# Altium schematic sheet Sheet2.SchDoc
size A4; SheetNumber: 1; SheetTotal: 1
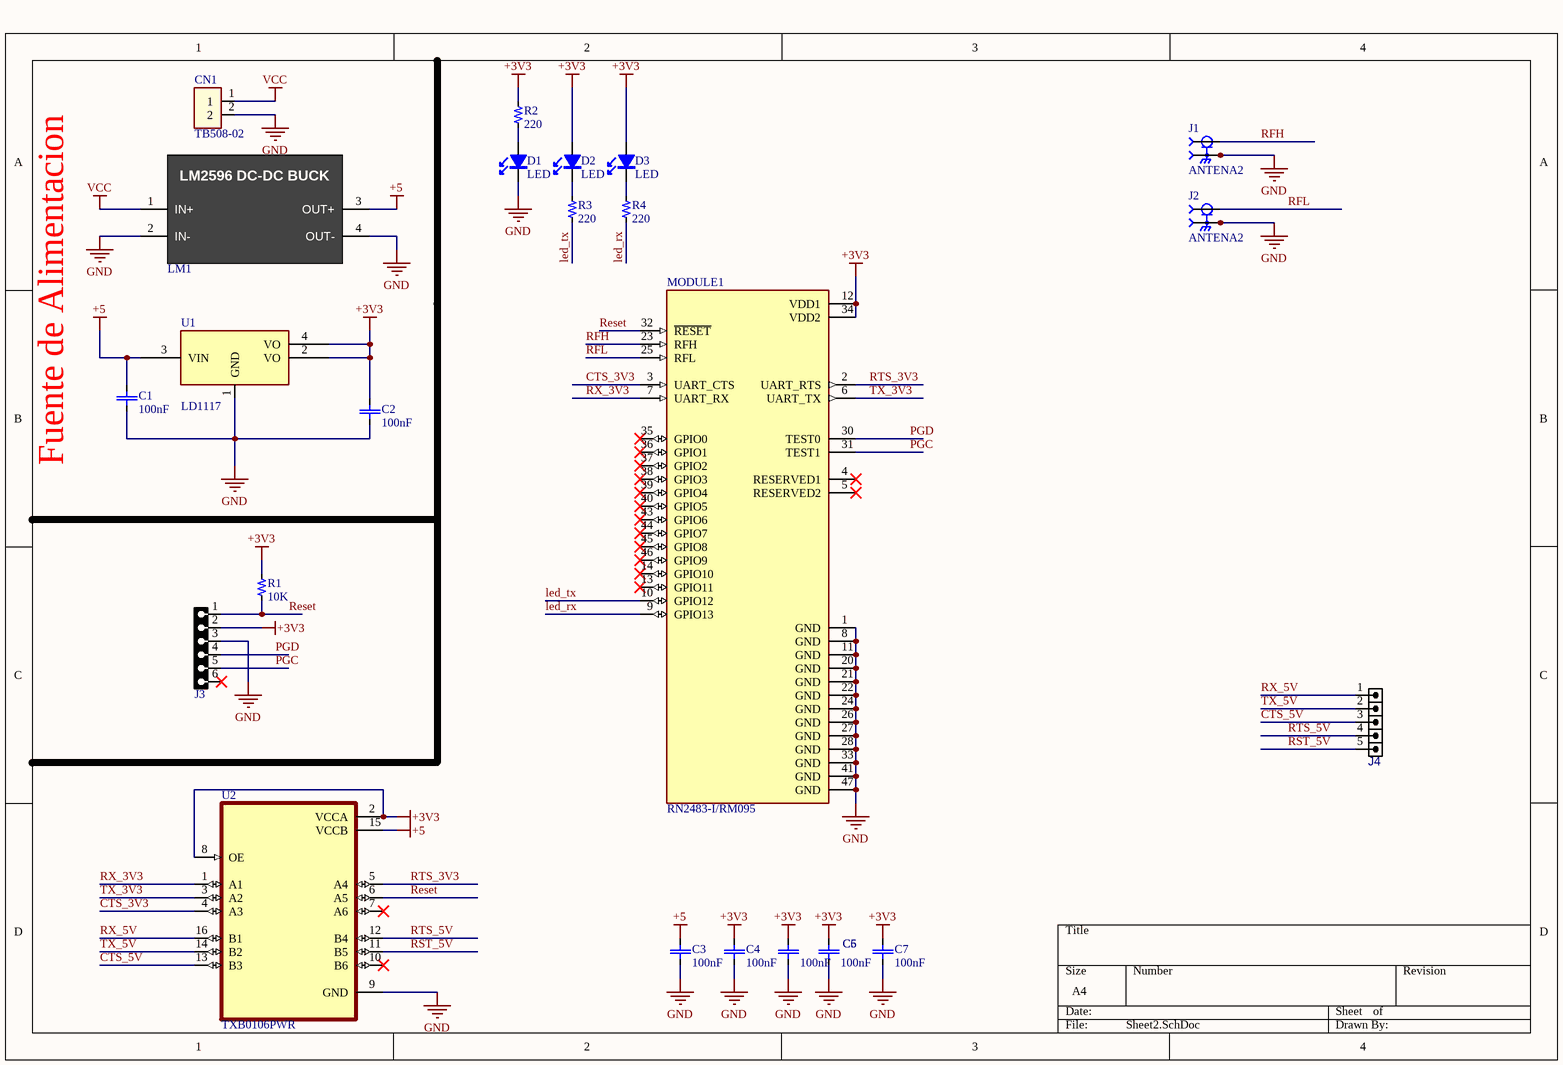
[diagram p0: Sheet2.SchDoc]

## Parts
C1  100nF  [C0805]
C2  100nF  [C0805]
C3  100nF  [C0805]
C4  100nF  [C0805]
C5  100nF  [C0805]
C6  100nF  [C0805]
C7  100nF  [C0805]
CN1  TB508-02  [TB508-02]
D1  LED  [LED-0805]
D2  LED  [LED-0805]
D3  LED  [LED-0805]
J1  ANTENA2  [SAMTEC_SMA-J-P-X-ST-MT1]
J2  ANTENA2  [SAMTEC_SMA-J-P-X-ST-MT1]
J3  HDRF6  [HDRRS_F_1X6]  (value not drawn)
J4  HDRM5  [HDRS_M_1X5]  (value not drawn)
LM1  LM2596?  [LM2596 - 3D]  (value not drawn)
MODULE1  RN2483-I/RM095  [MICROCHIP_RN2483-I/RM095]
R1  10K  [R0805]
R2  220  [R0805]
R3  220  [R0805]
R4  220  [R0805]
U1  LD1117  [SOT223_4]
U2  TXB0106PWR  [SOP65P640X120-16N]

## Nets
+3V3: C2.2 C4.2 C5.2 C6.2 C7.2 D2.2 D3.2 J3.2 MODULE1.12(VDD1) MODULE1.34(VDD2) R1.2 R2.2 U1.2(VO) U1.4(VO) U2.2(VCCA) U2.8(OE)
+5: C1.2 C3.2 LM1.3(OUT+) U1.3(VIN) U2.15(VCCB)
GND: C1.1 C2.1 C3.1 C4.1 C5.1 C6.1 C7.1 CN1.2 D1.1 J1.2 J1.3 J1.4 J1.5 J2.2 J2.3 J2.4 J2.5 J3.3 LM1.2(IN-) LM1.4(OUT-) MODULE1.1(GND) MODULE1.8(GND) MODULE1.11(GND) MODULE1.20(GND) MODULE1.21(GND) MODULE1.22(GND) MODULE1.24(GND) MODULE1.26(GND) MODULE1.27(GND) MODULE1.28(GND) MODULE1.33(GND) MODULE1.41(GND) MODULE1.47(GND) U1.1(GND) U2.9(GND)
VCC: CN1.1 LM1.1(IN+)
CTS_3V3: MODULE1.3(UART_CTS) U2.4(A3)
CTS_5V: J4.3 U2.13(B3)
led_rx: MODULE1.9(GPIO13) R4.1
led_tx: MODULE1.10(GPIO12) R3.1
PGC: J3.5 MODULE1.31(TEST1)
PGD: J3.4 MODULE1.30(TEST0)
Reset: J3.1 MODULE1.32(~{RESET}) R1.1 U2.6(A5)
RFH: J1.1 MODULE1.23(RFH)
RFL: J2.1 MODULE1.25(RFL)
RST_5V: J4.5 U2.11(B5)
RTS_3V3: MODULE1.2(UART_RTS) U2.5(A4)
RTS_5V: J4.4 U2.12(B4)
RX_3V3: MODULE1.7(UART_RX) U2.1(A1)
RX_5V: J4.1 U2.16(B1)
TX_3V3: MODULE1.6(UART_TX) U2.3(A2)
TX_5V: J4.2 U2.14(B2)
NetD1_2: D1.2 R2.1
NetD2_1: D2.1 R3.2
NetD3_1: D3.1 R4.2

Not connected (* = marked no-connect by the designer): J3 6*; MODULE1 4(RESERVED1)* 5(RESERVED2)* 13(GPIO11)* 14(GPIO10)* 35(GPIO0)* 36(GPIO1)* 37(GPIO2)* 38(GPIO3)* 39(GPIO4)* 40(GPIO5)* 43(GPIO6)* 44(GPIO7)* 45(GPIO8)* 46(GPIO9)*; U2 7(A6)* 10(B6)*

## Notes on the sheet
- Fuente de Alimentacion
- (in symbol LM2596?) LM2596 DC-DC BUCK

## Library data of the parts
C1-C7 = Capacitor: Capacitor without polarity; Voltage: 25V; Part number: *; Manufacturer: *; Unit price: *; Value: 100nF
CN1 = TB-02: Terminal Block; Manufacturer: *; Part number: *; Unit price: *; Value: TB508-02
D1-D3 = LED: LED - Light-Emitting Diode; Manufacturer: *; Part number: *; Unit price: *; Value: LED
J1 J2 = SMA-J-P-X-ST-MT1: SMA Connector Jack, Female Socket 50Ohm Surface Mount, Through Hole Solder; MF: Samtec; MP: SMA-J-P-H-ST-MT1; Availability: Unavailable; SnapEDA_Link: https://www.snapeda.com/parts/SMA-J-P-H-ST-MT1/Samtec%20Inc./view-part/134501/?ref=snap; Toby_UK-Purchase-URL: https://snapeda.com/shop?store=Toby+UK&id=134501; Price: None; Package: None; Value: *
J3 = Header Female smd 1x6 horizontal: CONN, HEADER, Female, pitch: 2.54mm, 6POS; VALUE: HDRF6
J4 = Header Male 1x5 smd: CONN, HEADER, Male, pitch: 2.54mm, 5POS, SMD; MANF_P#: PBC36SAAN; MANF: Sullins; DESC: DESCRIPTION; ASSEMBLY: ASSEMBLY; PARAM: PARAM; PRICE: PRICE; VALUE: HDRM5
LM1 = LM2596?: Módulo de DC-DC LM2596, regulador de convertidor Buck de reducción ajustable, VIN: 3,2 V-40V ; VOUT: 1,25 V-35V
MODULE1 = RN2483-I/RM095: Sub-GHz Dual Band Long Range Transceiver LoRa Module; MF: Microchip; Package: None; MP: RN2483-I/RM095; Value: *; Availability: Unavailable; SnapEDA_Link: https://www.snapeda.com/parts/RN2483-I/RM095/Microchip/view-part/378307/?ref=snap; Price: None
R1-R4 = Resistor: Single resistor; Value: 1k0; Power: 0.125W; Manufacturer: *; Part number: *; Unit price: 0.1
U1 = VREG_1117_SOT223: REG, Linear, LDO1V, 0.8A, SOT-223; MANF_P#: LD1117, LM1117, AMS1117, TLV1117, REG1117, NCP1117, LT1117, SPX1117; MANF: TI, ON, ST; PARAM2: 1.2/1.5/1.8/2.5/2.85/3.3/5V; PARAM: LDO1V, 0.8A; VALUE: LD1117
U2 = TXB0106PWR: 6-Bit Bidirectional Voltage-Level Translator with Auto Direction Sensing and +/-15-kV ESD Protect 16-TSSOP -40 to 85; MF: Texas Instruments; Texas_Instruments-Purchase-URL: https://snapeda.com/shop?store=Texas+Instruments&id=134340; SnapEDA_Link: https://www.snapeda.com/parts/TXB0106PWR/Texas%20Instruments/view-part/134340/?ref=snap; Value: *; MP: TXB0106PWR; Package: TSSOP-16 Texas Instruments; DigiKey-Purchase-URL: https://snapeda.com/shop?store=DigiKey&id=134340; Availability: Warning; Price: None; Mouser-Purchase-URL: https://snapeda.com/shop?store=Mouser&id=134340